# EasyEDA Pro project ProPrj_超市储物柜控制系统_2026-05-10.epro

# Schematic Schematic1
Assembly Variant: Basic; Board Name: Board1; Create Date: 2026-04-28; Page Name: P1; Project Name: 超市储物柜控制系统; Schematic Name: Schematic1; Update Date: 2026-04-28; BladeWidth: 10; Company: 嘉立创EDA; Page Size: A4; RegionStart: 1; ShowBorder: 1; TitleBlock: 1; TitleBlockPosition: 3; Version: V1.0; XRegionCount: 6; YRegionCount: 4
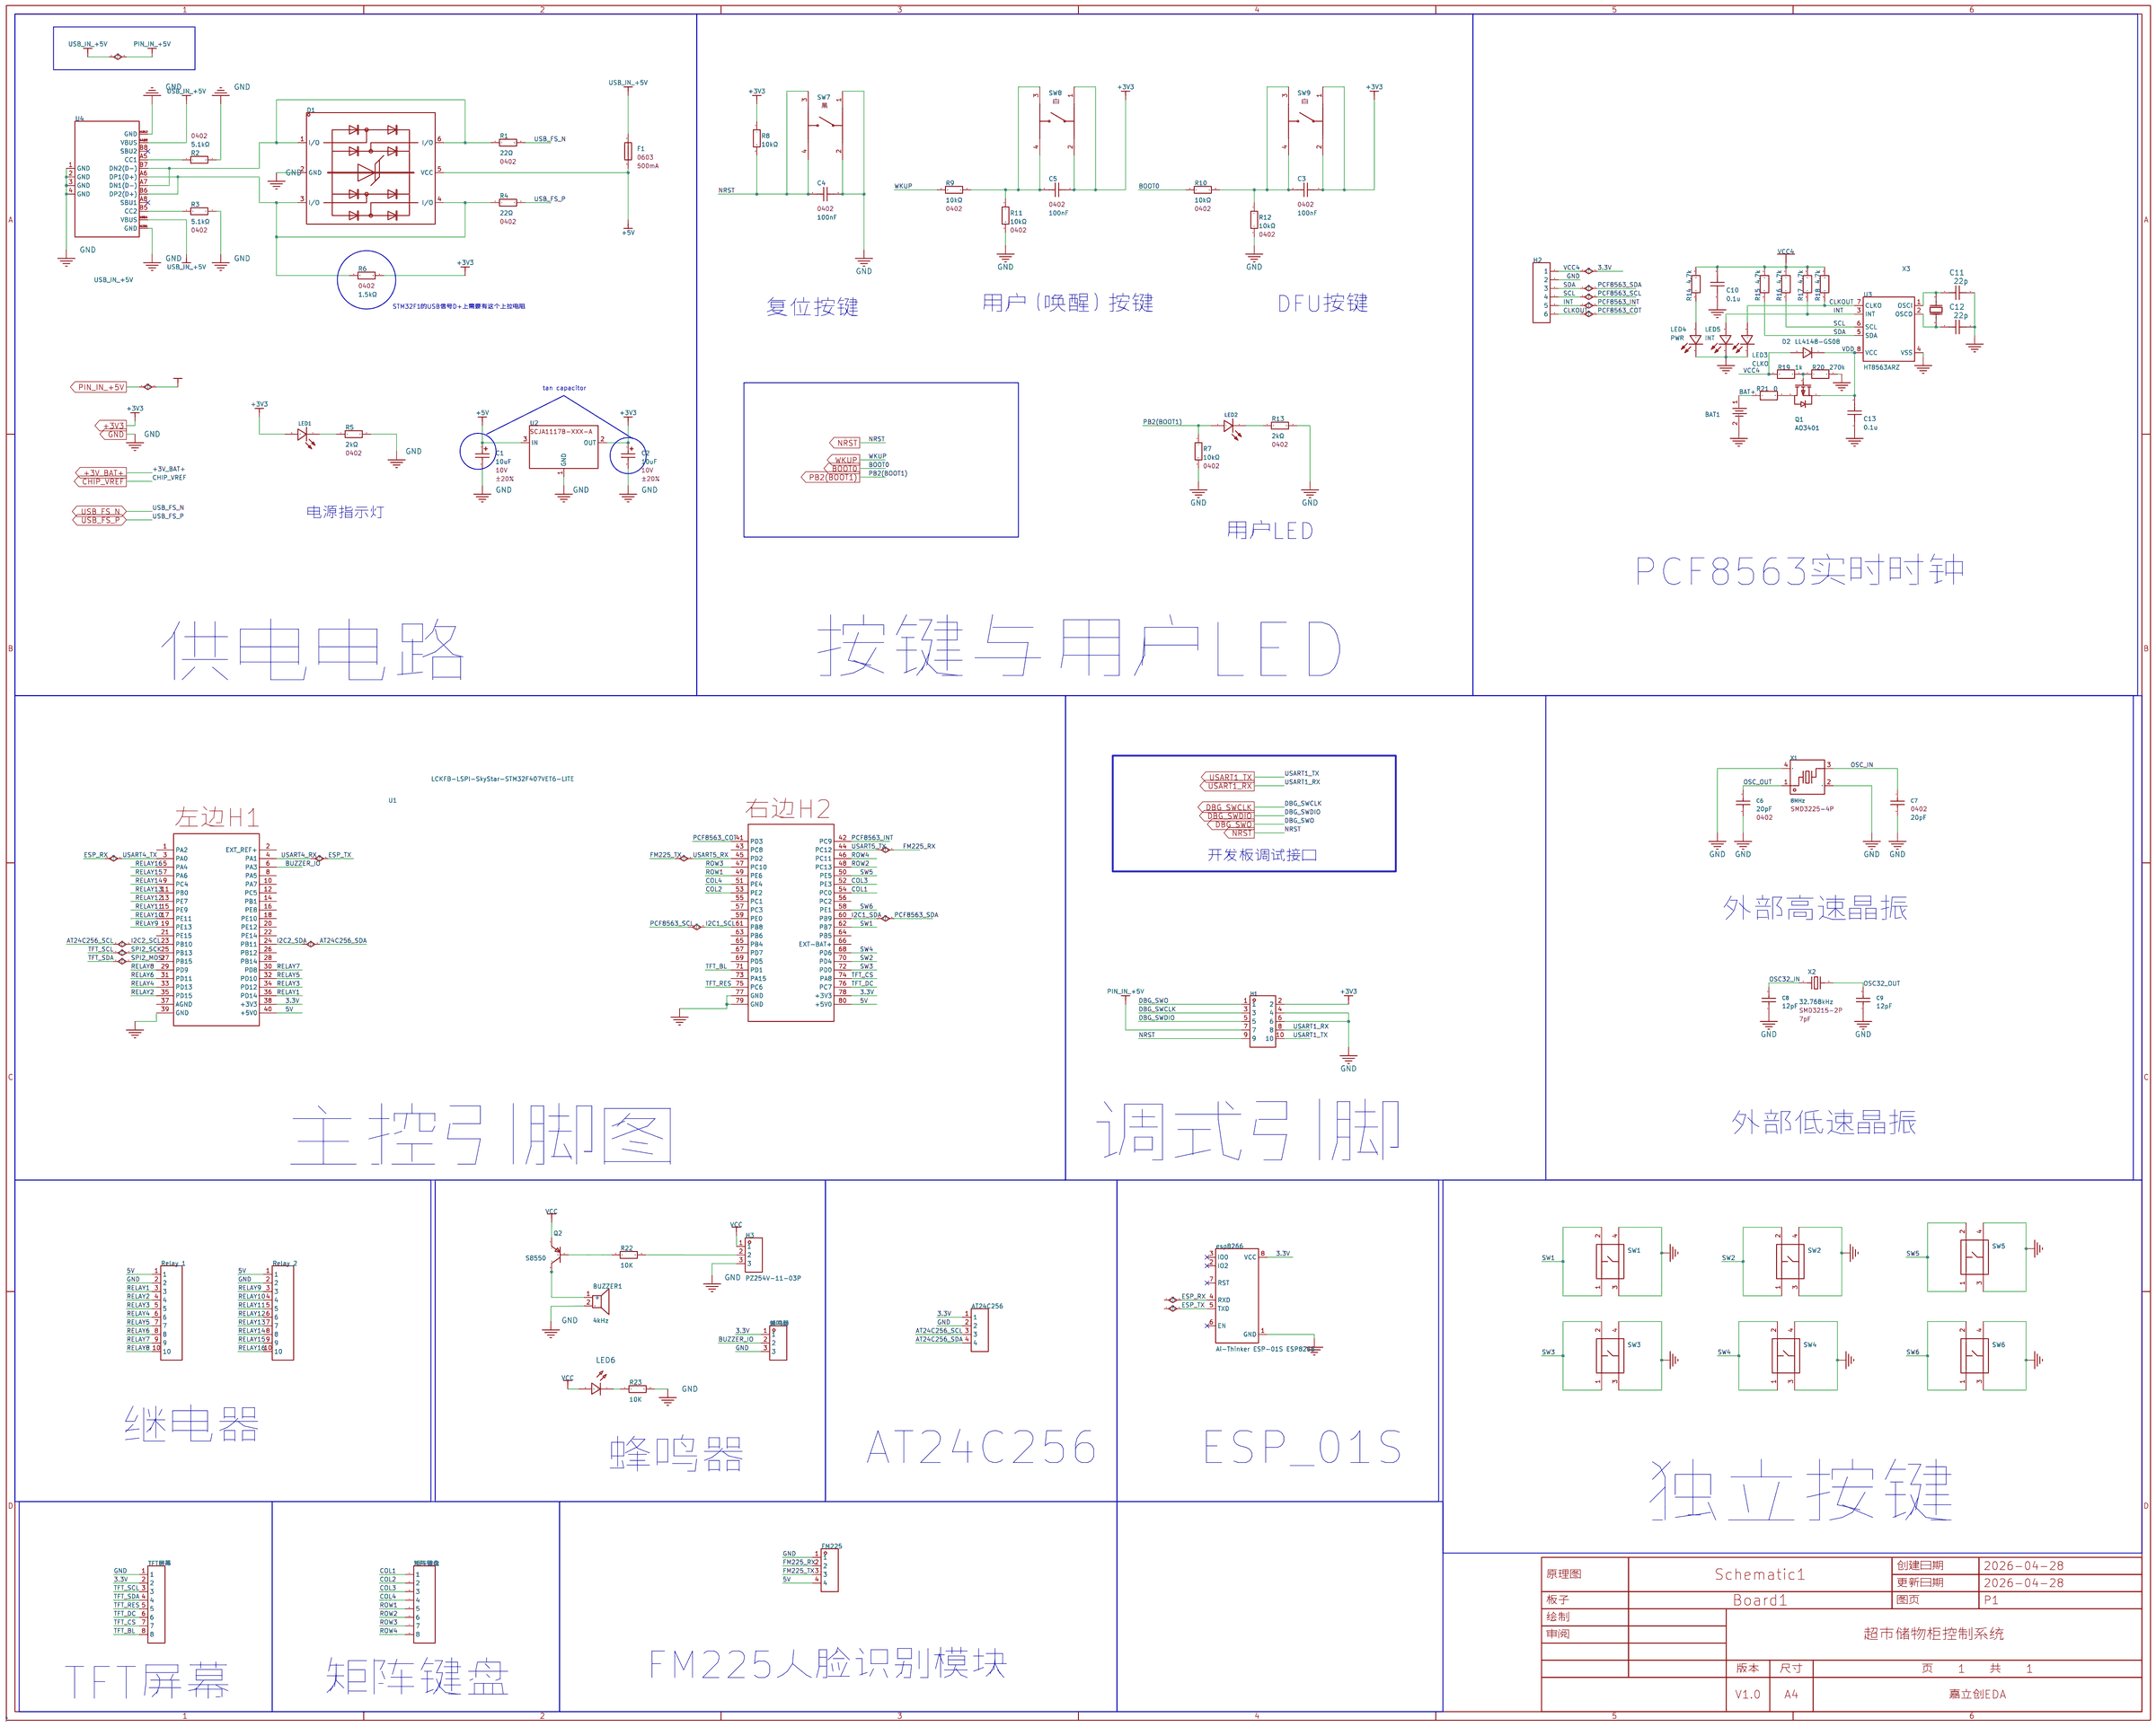
[diagram p0: schematic sheet]

## Parts
AT24C256  -  [HDR-TH_4P-P2.54-V-M]
BAT1  -  [BAT-TH_BS-02-A1AK006]
BUZZER1  4kHz  [BUZ-TH_BD12.0-P6.50-D0.6-FD]
C1  10uF  [CASE-A_3216]
C2  10uF  [CASE-A_3216]
C3  100nF  [C0402]
C4  100nF  [C0402]
C5  100nF  [C0402]
C6  20pF  [C0402(small)]
C7  20pF  [C0402(small)]
C8  12pF  [C0402(small)]
C9  12pF  [C0402(small)]
C10  0.1u  [C0805]
C11  22p  [C0805]
C12  22p  [C0805]
C13  0.1u  [C0805]
D1  BST236A054U  [SOT-23-6_L2.9-W1.6-P0.95-LS2.8-BR]
D2  LL4148-GS08  [SOD-80_L3.5-W1.5-RD]
esp8266  Ai-Thinker ESP-01S ESP8266  [WIFIM-TH_8P-L24.7-W14.4-P2.54]
F1  BSMD0603-050-6V  [F0603]
FM225  -  [HDR-TH_4P-P2.54-V-F]
H1  PZ254V-12-10P  [HDR-TH_10P-P2.54-V-M-R2-C5-S2.54]
H2  -  [HDR-TH_6P-P2.54-V-M-1]
H3  PZ254V-11-03P  [HDR-TH_3P-P2.54-V-M]
LED1  NCD0402R1  [LED0402-RD]
LED2  NCD0402G1  [LED0402-RD]
LED3  CLKO  [LED0805-R-RD]
LED4  PWR  [LED0805-R-RD]
LED5  INT  [LED0805-R-RD]
LED6  -  [LED_0805]
Q1  AO3401  [SOT-23-3_L2.9-W1.4-P1.90-LS2.6-BR]
Q2  S8550  [SOT-23-3_L2.9-W1.3-P1.90-LS2.4-BR]
R1  22Ω  [R0402]
R2  5.1kΩ  [R0402]
R3  5.1kΩ  [R0402]
R4  22Ω  [R0402]
R5  2kΩ  [R0402]
R6  1.5kΩ  [R0402]
R7  10kΩ  [R0402]
R8  10kΩ  [R0402]
R9  10kΩ  [R0402]
R10  10kΩ  [R0402]
R11  10kΩ  [R0402]
R12  10kΩ  [R0402]
R13  2kΩ  [R0402]
R14  4.7k  [R0805]
R15  4.7k  [R0805]
R16  4.7k  [R0805]
R17  4.7k  [R0805]
R18  4.7k  [R0805]
R19  1k  [R0603]
R20  270k  [R0603]
R21  0  [R0603]
R22  10K  [R0805]
R23  10K  [R0805]
Relay_1  -  [HDR-TH_10P-P2.54-V-M-1]
Relay_2  -  [HDR-TH_10P-P2.54-V-M-1]
SW1  K2-1102DP-C4SW-04  [KEY-TH_4P-L6.0-W6.0-P4.50-LS6.50]
SW2  K2-1102DP-C4SW-04  [KEY-TH_4P-L6.0-W6.0-P4.50-LS6.50]
SW3  K2-1102DP-C4SW-04  [KEY-TH_4P-L6.0-W6.0-P4.50-LS6.50]
SW4  K2-1102DP-C4SW-04  [KEY-TH_4P-L6.0-W6.0-P4.50-LS6.50]
SW5  K2-1102DP-C4SW-04  [KEY-TH_4P-L6.0-W6.0-P4.50-LS6.50]
SW6  K2-1102DP-C4SW-04  [KEY-TH_4P-L6.0-W6.0-P4.50-LS6.50]
SW7  TSA017A2540A03  [SW-SMD_4P-L4.2-W3.4-P2.15-LS5.2]
SW8  TSA017A2540A07  [SW-SMD_4P-L4.2-W3.4-P2.15-LS5.2]
SW9  TSA017A2540A07  [SW-SMD_4P-L4.2-W3.4-P2.15-LS5.2]
TFT屏幕  -  [HDR-TH_8P-P2.54-V-F-1]
U1  LCKFB-LSPI-SkyStar-STM32F407VET6-LITE  [COMM-TH_LCKFB-LSPI-SKYSTAR-STM32F407VET6-LITE]
U2  SCJA1117B-3.3-A  [SOT-89-3L_L4.5-W2.5-P1.50-LS4.1-BR]
U3  HT8563ARZ  [SOIC-8_L5.0-W4.0-P1.27-LS6.0-TL]
U4  USB-TYPE-C-019  [TYPE-C-SMD_HX-TYPE-C-16PIN]
X1  8MHz  [OSC-SMD_4P-L3.2-W2.5-BL]
X2  32.768kHz  [OSC-SMD_L3.2-W1.5]
X3  -  [32768晶振]
矩阵键盘  -  [HDR-TH_8P-P2.54-V-M]
蜂鸣器  -  [HDR-TH_3P-P2.54-V-M]

## Library data of the parts
AT24C256 = HDR-M_2.54_1x4P: Supplier Part: C492403; Supplier Footprint: 插件
BAT1 = CR2032电池座
BUZZER1 = SEA-12095-0540-42Ω-40P6.5: 驱动方式:无源(外部驱动);频率:4kHz;声压(SPL):85dB;; Supplier Part: C7428406; Manufacturer: S&S(海旭); Supplier Footprint: 插件,D=12mm; JLCPCB Part Class: 扩展库; Datasheet: https://item.szlcsc.com/datasheet/SEA-12095-0540-42%25CE%25A9-40P6.5/8424084.html; Supplier: LCSC; Driver Circuitry: 无源(外部驱动); Voltage - Supply: 5V; Sound Pressure Level(SPL): 85dB; Diameter(φD): 12mm; Height: 9.7mm
C1 C2 = CA45-A010M106T: 容值:10uF;精度:±20%;额定电压:10V;等效串联电阻:3Ω@100kHz;; LCSC Part Name: 10uF ±20% 10V; Supplier Part: C127946; Manufacturer: 湘怡中元/湘江; Supplier Footprint: CASE-A-3216; JLCPCB Part Class: 扩展库; Datasheet: https://atta.szlcsc.com/upload/public/pdf/source/20181017/C127946_A4A6D142F17DBAC79544D5AF423E91AE.pdf; Supplier: LCSC; Tolerance: ±20%; Rated Voltage: 10V; Equivalent Series Resistance(ESR): 3Ω@100kHz; Operating Temperature: -55℃~+125℃
C3-C5 = CC0402KRX7R7BB104: 容值:100nF;精度:±10%;额定电压:16V;材质(温度系数):X7R;; LCSC Part Name: 100nF ±10% 16V; Supplier Part: C60474; Manufacturer: YAGEO(国巨); Supplier Footprint: 0402; Datasheet: https://atta.szlcsc.com/upload/public/pdf/source/20211223/9278FD768280B81DDBEF48FA36411A03.pdf; Supplier: LCSC; Tolerance: ±10%; Voltage Rated: 16V; Temperature Coefficient: X7R
C6 C7 = 0402CG200J500NT: 容值:20pF;精度:±5%;额定电压:50V;材质(温度系数):C0G;; LCSC Part Name: 20pF ±5% 50V; Supplier Part: C1554; Manufacturer: FH(风华); Supplier Footprint: 0402; JLCPCB Part Class: 基础库; Datasheet: https://atta.szlcsc.com/upload/public/pdf/source/20200305/C486355_26A10D38EF8C2A5C37091D0039909270.pdf; Supplier: LCSC; Tolerance: ±5%; Voltage Rated: 50V; Temperature Coefficient: C0G
C8 C9 = 0402CG6R0C500NT: 容值:12pF;精度:±5%;额定电压:50V;材质(温度系数):C0G;; LCSC Part Name: 12pF ±5% 50V; Supplier Part: C1547; Manufacturer: FH(风华); Manufacturer Part: 0402CG120J500NT; Supplier Footprint: 0402; JLCPCB Part Class: Basic Part; Datasheet: https://atta.szlcsc.com/upload/public/pdf/source/20200305/C486355_26A10D38EF8C2A5C37091D0039909270.pdf; Supplier: LCSC; Voltage Rated: 50V; Temperature Coefficient: C0G
C10 C13 = 0.1u: link: https://item.szlcsc.com/373011.html; 3DModel: C0805_L2.0-W1.3-H1.3
C11 C12 = 22p: link: https://item.szlcsc.com/373011.html; 3DModel: C0805_L2.0-W1.3-H1.3
D1 = BST236A054U（自修改）: 反向关断电压（典型值）:5V;击穿电压（最小值）:6V;极性:-;箝位电压:13V;峰值脉冲电流（10/1000us）:3.5A (8/20us);; Supplier Part: C406203; Manufacturer: BORN(伯恩半导体); Supplier Footprint: SOT23-6; JLCPCB Part Class: 扩展库; Datasheet: https://atta.szlcsc.com/upload/public/pdf/source/20190723/C406203_BF93A0BD7D0538F0A550B5A01DEB1E59.pdf; Supplier: LCSC
D2 = LL4148-GS08: 二极管配置:-;正向压降(Vf):860mV@50mA;直流反向耐压(Vr):75V;整流电流:300mA;反向恢复时间(Trr):-;; Supplier Part: C68883; Manufacturer: VISHAY(威世); Supplier Footprint: MiniMELF; JLCPCB Part Class: 扩展库; Datasheet: https://atta.szlcsc.com/upload/public/pdf/source/20160803/1470206543327.pdf; Supplier: LCSC; Voltage - Forward(Vf@If): 860mV@50mA; Voltage - DC Reverse(Vr): 75V; Current - Rectified: 300mA; Reverse Leakage Current (Ir): 5uA@75V
esp8266 = Ai-Thinker ESP-01S ESP8266: Supplier Part: C17606792; Manufacturer: Ai-Thinker(安信可); JLCPCB Part Class: Extended Part; Datasheet: https://item.szlcsc.com/datasheet/Ai-Thinker%2520ESP-01S%2520ESP8266/18736031.html; Supplier: LCSC
F1 = BSMD0603-050-6V: 最大电压:6V;最大电流:40A;保持电流:500mA;跳闸电流:1A;; LCSC Part Name: 6V 500mA 0603自恢复; Supplier Part: C883095; Manufacturer: BHFUSE(佰宏); Supplier Footprint: 0603; JLCPCB Part Class: 扩展库; Datasheet: https://atta.szlcsc.com/upload/public/pdf/source/20220302/2A4AFA61964160B34367BDE2745D6217.pdf; Supplier: LCSC; Operating Voltage (Max): 6V; Current Rating (Max): 40A; Hold Current: 500mA; Trip Current: 1A; Power Dissipation: 500mW; Resistance - Initial (Ri) (Min): 100mΩ; Resistance - Post Trip (R1) (Max): 800mΩ; Maximum Time to Trip: 100ms; Operating Temperature: -40℃~+85℃
FM225 = HDR-F_2.54_1x4P: Supplier Part: C2718488; Supplier Footprint: 插件
H1 = PZ254V-12-10P（改成侧插）: 排数:双排;总PIN位数:10;间距:2.54mm;插针结构:2x5P;行距:2.54mm;安装类型:直插;圆针/方针:方针;额定电流:-;额定电压:-;配合针长度:6mm;塑高:2.5mm;端接针长度:3mm;触头材质:黄铜;触头镀层:-;工作温度范围:-40℃~+105℃;颜色:黑色;; LCSC Part Name: 2.54mm 2x5P 直插 方针; Supplier Part: C492422; Manufacturer: XFCN(兴飞); Supplier Footprint: 直插,P=2.54mm; JLCPCB Part Class: 扩展库; Supplier: LCSC; Number of Rows: 双排; Number of Pins: 10; Pitch: 2.54mm; Pin Structure: 2x5P; Row Spacing: 2.54mm; Mounting Type: 直插; Circluar Pins/Square Pins: 方针; Length of Mating Pin: 6mm; Insulation Height: 2.5mm; Length of End Connection Pin: 3mm; Contact Material: 黄铜; Operating Temperature Range: -40℃~+105℃; Color: 黑色
H2 = HDR-M_2.54_1x6P: Supplier Part: C37208; Supplier Footprint: 插件
H3 = PZ254V-11-03P: 插针结构:1x3P;间距:2.54mm;行距:-;圆针/方针:方针;安装方式:直插;排数:单排;总PIN位数:3P;额定电流:3A;额定电压:250V;配合针长度:6mm;塑高:2.5mm;端接针长度:3mm;工作温度:-40℃~+105℃;颜色:黑色;; LCSC Part Name: 1x3P 间距:2.54mm 方针 直插; Supplier Part: C2937625; Manufacturer: XFCN(兴飞); Supplier Footprint: 插件,P=2.54mm; JLCPCB Part Class: Extended Part; Datasheet: https://item.szlcsc.com/datasheet/PZ254V-11-03P/3293280.html; Supplier: LCSC; Pin Structure: 1x3P; Pitch: 2.54mm; Circluar Pins/Square Pins: 方针; Mounting Type: 直插; Number of Rows: 单排; Number of Pins: 3P; Current Rating: 3A; Voltage Rating (Max): 250V; Length of Mating Pin: 6mm; Insulation Height: 2.5mm; Length of End Connection Pin: 3mm; Operating Temperature: -40℃~+105℃; Color: 黑色
LED1 = NCD0402R1: 发光颜色:红灯;; Supplier Part: C130719; Manufacturer: 国星光电; Supplier Footprint: 0402; JLCPCB Part Class: 扩展库; Datasheet: https://atta.szlcsc.com/upload/public/pdf/source/20200820/C130719_A72EA5A7FEC83C35856EA0453E4EE775.pdf; Supplier: LCSC; Emitted Color: 红灯
LED2 = NCD0402G1: 发光颜色:翠绿;; LCSC Part Name: 翠绿 0402翠绿       正贴; Supplier Part: C130723; Manufacturer: 国星光电; Supplier Footprint: 0402; JLCPCB Part Class: 扩展库; Datasheet: https://atta.szlcsc.com/upload/public/pdf/source/20200820/C130723_D39B4171A1B8D8D2F39C1DC521C0922A.pdf; Supplier: LCSC; Emitted Color: 翠绿
LED3-LED5 = LED_Green
LED6 = LED_0805-R: Supplier Footprint: 0805
Q1 = AO3401_C727156: 类型:1个P沟道;漏源电压(Vdss):30V;连续漏极电流(Id):4.2A;导通电阻(RDS(on)@Vgs,Id):65mΩ@10V,4.2A;功率:350mW;阈值电压(Vgs(th)@Id):1.3V@250uA;; LCSC Part Name: 1个P沟道 耐压:30V 电流:4.2A; Supplier Part: C727156; Manufacturer: TWGMC(台湾迪嘉); Supplier Footprint: SOT-23; JLCPCB Part Class: 扩展库; Datasheet: https://atta.szlcsc.com/upload/public/pdf/source/20200827/C727156_6E081BBEEFBC6B8FEE164CB196B0AF30.pdf; Supplier: LCSC; Type: 1个P沟道; Drain Source Voltage (Vdss): 30V; Continuous Drain Current (Id): 4.2A; Drain Source On Resistance (RDS(on)@Vgs,Id): 65mΩ@10V,4.2A; Power Dissipation (Pd): 350mW; Gate Threshold Voltage (Vgs(th)@Id): 1.3V@250uA; Input Capacitance (Ciss@Vds): 954pF; Reverse Transfer Capacitance (Crss@Vds): 77pF; Operating Temperature: -55℃~+150℃
Q2 = S8550_C5184407: 晶体管类型:PNP;集电极电流(Ic):500mA;集射极击穿电压(Vceo):25V;耗散功率(Pd):300mW;直流电流增益(hFE):120@50mA,1V;; LCSC Part Name: PNP 电流:0.5A 电压:25V; Supplier Part: C5184407; Manufacturer: HXY MOSFET(华轩阳电子); Supplier Footprint: SOT-23; JLCPCB Part Class: 扩展库; Datasheet: https://item.szlcsc.com/datasheet/S8550/5849843.html; Supplier: LCSC; type: PNP; Current - Collector(Ic): 500mA; Collector - Emitter Voltage VCEO: 25V; Pd - Power Dissipation: 300mW; DC Current Gain: 120@50mA,1V; Transition frequency(fT): 150MHz; Current - Collector Cutoff: 100nA; Vce Saturation(VCE(sat)): 600mV
R1 R4 = RC0402FR-0722RL: 电阻类型:厚膜电阻;阻值:22Ω;精度:±1%;功率:62.5mW;; LCSC Part Name: 22Ω ±1% 62.5mW; Supplier Part: C114765; Manufacturer: YAGEO(国巨); Supplier Footprint: 0402; JLCPCB Part Class: 扩展库; Datasheet: https://atta.szlcsc.com/upload/public/pdf/source/20170912/C114765_1505207820880963483.pdf; Supplier: LCSC; Type: 厚膜电阻; Tolerance: ±1%; Power(Watts): 62.5mW; Temperature Coefficient: ±100ppm/℃; Overload Voltage (Max): 50V; Operating Temperature Range: -55℃~+155℃
R2 R3 = RC0402FR-075K1L: 电阻类型:厚膜电阻;阻值:5.1kΩ;精度:±1%;功率:62.5mW;; LCSC Part Name: 5.1kΩ ±1% 62.5mW; Supplier Part: C105872; Manufacturer: YAGEO(国巨); Supplier Footprint: 0402; JLCPCB Part Class: 扩展库; Datasheet: https://atta.szlcsc.com/upload/public/pdf/source/20170912/C105872_1505207464555963229.pdf; Supplier: LCSC; Type: 厚膜电阻; Tolerance: ±1%; Power(Watts): 62.5mW; Temperature Coefficient: ±100ppm/℃; Overload Voltage (Max): 50V; Operating Temperature Range: -55℃~+155℃
R5 R13 = 0402WGF2001TCE: 电阻类型:厚膜电阻;阻值:2kΩ;精度:±1%;功率:62.5mW;; LCSC Part Name: 2kΩ ±1% 62.5mW; Supplier Part: C4109; Manufacturer: UNI-ROYAL(厚声); Supplier Footprint: 0402; JLCPCB Part Class: 基础库; Datasheet: https://atta.szlcsc.com/upload/public/pdf/source/20200306/C422600_1E6D84923E4A46A82E41ADD87F860B5C.pdf; Supplier: LCSC; Type: 厚膜电阻; Tolerance: ±1%; Power(Watts): 62.5mW; Temperature Coefficient: ±100ppm/℃; Overload Voltage (Max): 50V; Operating Temperature Range: -55℃~+155℃
R6 = 0402WGF1501TCE: 电阻类型:厚膜电阻;阻值:1.5kΩ;精度:±1%;功率:62.5mW;; LCSC Part Name: 1.5kΩ ±1% 62.5mW; Supplier Part: C25867; Manufacturer: UNI-ROYAL(厚声); Supplier Footprint: 0402; JLCPCB Part Class: 基础库; Datasheet: https://atta.szlcsc.com/upload/public/pdf/source/20200306/C422600_1E6D84923E4A46A82E41ADD87F860B5C.pdf; Supplier: LCSC; Type: 厚膜电阻; Tolerance: ±1%; Power(Watts): 62.5mW; Temperature Coefficient: ±100ppm/℃; Overload Voltage (Max): 50V; Operating Temperature Range: -55℃~+155℃
R7-R12 = RC0402FR-0710KL: 电阻类型:厚膜电阻;阻值:10kΩ;精度:±1%;功率:62.5mW;; LCSC Part Name: 10kΩ ±1% 62.5mW; Supplier Part: C60490; Manufacturer: YAGEO(国巨); Supplier Footprint: 0402; JLCPCB Part Class: 扩展库; Datasheet: https://atta.szlcsc.com/upload/public/pdf/source/20170606/1496716515432.pdf; Supplier: LCSC; Type: 厚膜电阻; Tolerance: ±1%; Power(Watts): 62.5mW; Temperature Coefficient: ±100ppm/℃; Overload Voltage (Max): 50V; Operating Temperature Range: -55℃~+155℃
R14-R18 R21 = 4.7k_0805: link: https://item.szlcsc.com/142685.html; 3DModel: R0805_L2.0-W1.3-H0.6
R19 R20 = 1k_0805: link: https://item.szlcsc.com/142685.html; 3DModel: R0805_L2.0-W1.3-H0.6
R22 R23 = Res_0805: Supplier Footprint: 0805
Relay_1 Relay_2 = HDR-M_2.54_1x10P: Supplier Part: C57369; Supplier Footprint: 插件
SW1-SW6 = K2-1102DP-C4SW-04: 电路结构:单刀单掷;按钮形状:圆形按钮;作用力:2.5N;安装方式:直插;开关长度:6mm;开关宽度:6mm;开关高度:5mm;触点电流:50mA;额定电压:12V;带灯:-;工作寿命:10万次;; LCSC Part Name: 轻触按键开关6*6*5; Supplier Part: C110153; Manufacturer: 韩国韩荣; Supplier Footprint: 插件-4P,6x6mm; JLCPCB Part Class: Extended Part; Datasheet: https://item.szlcsc.com/datasheet/K2-1102DP-C4SW-04/111374.html; Supplier: LCSC; Circuit: 单刀单掷; Actuator Style: 圆形按钮; Operating Force: 2.5N; Mounting Type: 直插; Length: 6mm; Width: 6mm; Switch Height: 5mm; Contact Current: 50mA; Voltage Rating: 12V; Life: 10万次; Operating Temperature: -25℃~+85℃
SW7 = TSA017A2540A03: 触点电流:50mA;额定电压(AC):-;额定电压(DC):12V;安装方式:立贴;机械寿命:-;; LCSC Part Name: 4.2*3.35*2.5mm 立贴 轻触开关; Supplier Part: C2888435; Manufacturer: BZCN(博众电气); Supplier Footprint: SMD; JLCPCB Part Class: 扩展库; Datasheet: https://atta.szlcsc.com/upload/public/pdf/source/20210906/F29F74F1A6DE5E6C38338EAD973C3529.pdf; Supplier: LCSC; Contact Current: 50mA; Voltage Rating (DC): 12V; Mounting Style: 立贴; Actuator Style: 椭圆形按钮; Switch Length: 4.2mm; Switch Width: 3.35mm; Switch Height: 2.5mm; 键帽颜色: 黑
SW8 SW9 = TSA017A2540A07: 触点电流:50mA;额定电压(AC):-;额定电压(DC):12V;安装方式:立贴;机械寿命:-;; LCSC Part Name: 4.2*3.35*2.5mm 立贴 轻触开关; Supplier Part: C2888434; Manufacturer: BZCN(博众电气); Supplier Footprint: SMD; JLCPCB Part Class: 扩展库; Datasheet: https://atta.szlcsc.com/upload/public/pdf/source/20210906/F29F74F1A6DE5E6C38338EAD973C3529.pdf; Supplier: LCSC; Contact Current: 50mA; Voltage Rating (DC): 12V; Mounting Style: 立贴; Actuator Style: 椭圆形按钮; Switch Length: 4.2mm; Switch Width: 3.35mm; Switch Height: 2.5mm; 键帽颜色: 白
TFT屏幕 = HDR-F_2.54_1x8P: Supplier Part: C27438; Supplier Footprint: 插件
U1 = LCKFB-LSPI-SkyStar-STM32F407VET6-LITE: 单板,不送排针; LCSC Part Name: 立创·天空星开发板-STM32F407VET6-青春版; Supplier Part: C22370035; Manufacturer: 立创开发板; JLCPCB Part Class: Extended Part; Datasheet: https://item.szlcsc.com/datasheet/LCKFB-LSPI-SkyStar-STM32F407VET6-LITE/23849165.html; Supplier: LCSC
U2 = SCJA1117B-3.3-A（自修改）: Supplier Part: C2829327; Manufacturer: CJ(江苏长电/长晶); Supplier Footprint: SOT-89-3L; JLCPCB Part Class: 扩展库; Datasheet: https://atta.szlcsc.com/upload/public/pdf/source/20210820/B9D5D49B36ECC270645A4509A675D809.pdf; Supplier: LCSC
U3 = HT8563ARZ: Supplier Part: C2834465; Manufacturer: HTCSEMI(海天芯); Supplier Footprint: SOIC-8; JLCPCB Part Class: 扩展库; Datasheet: https://atta.szlcsc.com/upload/public/pdf/source/20210820/7D8BECBBB1F4BED9191CC1F7D794CAA1.pdf; Supplier: LCSC
U4 = USB-TYPE-C-019（自修改）: 修改原理图封装; Supplier: LCSC; Supplier Part: C2927039; Manufacturer: DEALON(德艺隆); link: https://atta.szlcsc.com/upload/public/pdf/source/20211217/AE540A2D77B84677A3A029B8D0DDD2E1.pdf; JLCPCB Part Class: 扩展库; Supplier Footprint: 插件
X1 = X32258MOB4SI: 频率:8MHz;频率公差:±10ppm;负载电容:12pF;; LCSC Part Name: 8MHz ±10ppm 12pF YSX321SL; Supplier Part: C2682775; Manufacturer: YXC(扬兴晶振); Supplier Footprint: SMD3225-4P; JLCPCB Part Class: 扩展库; Datasheet: https://atta.szlcsc.com/upload/public/pdf/source/20210106/C2682774_0CD4FDA5D9DA3FBEEC23BD607A48E4B0.pdf; Supplier: LCSC; Crystal Type: 贴片无源晶振; Frequency Tolerance: ±10ppm; Frequency Stability: ±30ppm; Load Capacitance: 12pF; Equivalent Series Resistance (ESR): 150Ω; Operating Temperature: -40℃~+85℃
X2 = XKXEL89CJI-SUAYLC-32.768K: 频率:32.768kHz;频率公差:±20ppm;负载电容:7pF;; LCSC Part Name: 32.768kHz ±20ppm 7pF YST310S; Supplier Part: C7528807; Manufacturer: YXC(扬兴晶振); Supplier Footprint: SMD3215-2P; Datasheet: https://atta.szlcsc.com/upload/public/pdf/source/20210329/C620155_E5A74FC0D27C5E9015A8D75DE9484FEA.pdf; Supplier: LCSC; Crystal Type: 贴片无源晶振; Frequency Tolerance: ±20ppm; Load Capacitance: 7pF; Operating Temperature: -40℃~+85℃
X3 = 32768Hz晶振
矩阵键盘 = HDR-M_2.54_1x8P: Supplier Part: C124381; Supplier Footprint: 插件
蜂鸣器 = HDR-M_2.54_1x3P: Supplier Part: C2937625; Supplier Footprint: 插件

## Nets
5V: FM225.4 Relay_1.1 Relay_2.1 U1.40(+5V0) U1.80(+5V0)
+3V3: C2.1 C3.1 C5.1 H1.2 LED1.2(A) R6.2 R8.1 SW8.1 SW8.2 SW9.1 SW9.2 U2.2(OUT)
+5V: C1.1 D1.5(VCC) F1.2 U2.3(IN)
GND: AT24C256.2 BAT1.2 C1.2 C2.2 C4.1 C6.1 C7.2 C8.1 C9.1 C10.1 C11.1 C12.1 C13.1 D1.2(GND) esp8266.1(GND) FM225.1 H1.4 H1.6 H2.2 LED3.2(K) LED4.2(K) LED5.2(K) R2.2 R3.2 R5.2 R7.2 R11.2 R12.2 R13.2 R20.2 Relay_1.2 Relay_2.2 SW1.3 SW1.4 SW2.3 SW2.4 SW3.3 SW3.4 SW4.3 SW4.4 SW5.3 SW5.4 SW6.3 SW6.4 SW7.1 SW7.2 TFT屏幕.1 U1.39(GND) U1.77(GND) U1.79(GND) U2.1(GND) U3.4(VSS) U4.1(GND) U4.2(GND) U4.3(GND) U4.4(GND) U4.A1B12(GND) U4.A12B1(GND) X1.2(GND) X1.4(GND) 蜂鸣器.3
VCC4: AT24C256.1 C10.2 D2.2(A) esp8266.8(VCC) H2.1 R14.2 R15.1 R16.1 R17.2 R18.2 R19.1 TFT屏幕.2 U1.38(+3V3) U1.78(+3V3) 蜂鸣器.1
VDD: C13.2 D2.1(C) Q1.2(S) U3.8(VCC)
AT24C256_SCL: AT24C256.3 U1.23(PB10)
AT24C256_SDA: AT24C256.4 U1.24(PB11)
BAT+: BAT1.1 R21.1
BOOT0: R10.1
BUZZER_IO: U1.6(PA3) 蜂鸣器.2
CLKOUT: H2.6 LED3.1(A) R18.1 U1.41(PD3) U3.7(CLKO)
COL1: U1.54(PC0) 矩阵键盘.1
COL2: U1.53(PE2) 矩阵键盘.2
COL3: U1.52(PE3) 矩阵键盘.3
COL4: U1.51(PE4) 矩阵键盘.4
DBG_SWCLK: H1.3
DBG_SWDIO: H1.5
DBG_SWO: H1.1
ESP_RX: esp8266.4(RXD) U1.3(PA0)
ESP_TX: esp8266.5(TXD) U1.4(PA1)
FM225_RX: FM225.2 U1.44(PC12)
FM225_TX: FM225.3 U1.45(PD2)
I2C1_SCL: H2.4 R16.2 U1.61(PB8) U3.6(SCL)
I2C1_SDA: H2.3 R15.2 U1.60(PB9) U3.5(SDA)
INT: H2.5 LED5.1(A) R17.1 U1.42(PC9) U3.3(INT)
NRST: C4.2 H1.9 R8.2 SW7.3 SW7.4
OSC32_IN: C8.2 X2.1
OSC32_OUT: C9.2 X2.2
OSC_IN: C7.1 X1.3
OSC_OUT: C6.2 X1.1
PB2(BOOT1): LED2.2(A) R7.1
PIN_IN_+5V: F1.1 H1.7 U4.A4B9(VBUS) U4.A9B4(VBUS)
RELAY1: Relay_1.3 U1.36(PD14)
RELAY2: Relay_1.4 U1.35(PD15)
RELAY3: Relay_1.5 U1.34(PD12)
RELAY4: Relay_1.6 U1.33(PD13)
RELAY5: Relay_1.7 U1.32(PD10)
RELAY6: Relay_1.8 U1.31(PD11)
RELAY7: Relay_1.9 U1.30(PD8)
RELAY8: Relay_1.10 U1.29(PD9)
RELAY9: Relay_2.3 U1.19(PE13)
RELAY10: Relay_2.4 U1.17(PE11)
RELAY11: Relay_2.5 U1.15(PE9)
RELAY12: Relay_2.6 U1.13(PE7)
RELAY13: Relay_2.7 U1.11(PB0)
RELAY14: Relay_2.8 U1.9(PC4)
RELAY15: Relay_2.9 U1.7(PA6)
RELAY16: Relay_2.10 U1.5(PA4)
ROW1: U1.49(PE6) 矩阵键盘.5
ROW2: U1.48(PC13) 矩阵键盘.6
ROW3: U1.47(PC10) 矩阵键盘.7
ROW4: U1.46(PC11) 矩阵键盘.8
SPI2_MOSI: TFT屏幕.4 U1.27(PB15)
SPI2_SCK: TFT屏幕.3 U1.25(PB13)
SW1: SW1.1 SW1.2 U1.62(PB7)
SW2: SW2.1 SW2.2 U1.70(PD4)
SW3: SW3.1 SW3.2 U1.72(PD0)
SW4: SW4.1 SW4.2 U1.68(PD6)
SW5: SW5.1 SW5.2 U1.50(PE5)
SW6: SW6.1 SW6.2 U1.58(PE1)
TFT_BL: TFT屏幕.8 U1.71(PD1)
TFT_CS: TFT屏幕.7 U1.74(PA8)
TFT_DC: TFT屏幕.6 U1.76(PC7)
TFT_RES: TFT屏幕.5 U1.75(PC6)
USART1_RX: H1.8
USART1_TX: H1.10
USB_FS_N: R1.2
USB_FS_P: R4.2
WKUP: R9.1
Net-(C3-2): C3.2 R10.2 R12.1 SW9.3 SW9.4
Net-(C5-2): C5.2 R9.2 R11.1 SW8.3 SW8.4
Net-(C11-2): C11.2 U3.1(OSCI) X3.1(OSC1)
Net-(C12-2): C12.2 U3.2(OSCO) X3.2(OSC2)
Net-(D1-1): D1.1(I/O) D1.6(I/O) R1.1 U4.A7(DN1(D-)) U4.B7(DN2(D-))
Net-(D1-3): D1.3(I/O) D1.4(I/O) R4.1 R6.1 U4.A6(DP1(D+)) U4.B6(DP2(D+))
Net-(LED1-1): LED1.1(K) R5.1
Net-(LED2-1): LED2.1(K) R13.1
Net-(LED4-1): LED4.1(A) R14.1
Net-(Q1-1): Q1.1(G) R19.2 R20.1
Net-(Q1-3): Q1.3(D) R21.2
Net-(R2-1): R2.1 U4.A5(CC1)
Net-(R3-1): R3.1 U4.B5(CC2)

Not connected (* = marked no-connect by the designer): BUZZER1 1(+) 2; esp8266 2(IO2)* 3(IO0)* 6(EN)* 7(RST)*; H3 1 2 3; LED6 1(C) 2(A); Q2 1(B) 2(E) 3(C); R22 1 2; R23 1 2; U1 1(PA2) 2(EXT REF+) 8(PA5) 10(PA7) 12(PC5) 14(PB1) 16(PE8) 18(PE10) 20(PE12) 21(PE15) 22(PE14) 26(PB12) 28(PB14) 37(AGND) 43(PC8) 55(PC1) 56(PC2) 57(PC3) 59(PE0) 63(PB6) 64(PB5) 65(PB4) 66(EXT-BAT+) 67(PD7) 69(PD5) 73(PA15); U4 A8(SBU1)* B8(SBU2)*

## Notes on the sheet
- STM32F1的USB信号D+上需要有这个上拉电阻
- 用户（唤醒）按键
- DFU按键
- 复位按键
- tan capacitor
- 电源指示灯
- 用户LED
- PCF8563实时时钟
- 供电电路
- 按键与用户LED
- 开发板调试接口
- 外部高速晶振
- 外部低速晶振
- 主控引脚图
- 调式引脚
- 继电器
- AT24C256
- ESP_01S
- 蜂鸣器
- 独立按键
- FM225人脸识别模块
- 矩阵键盘
- TFT屏幕

# Board PCB1
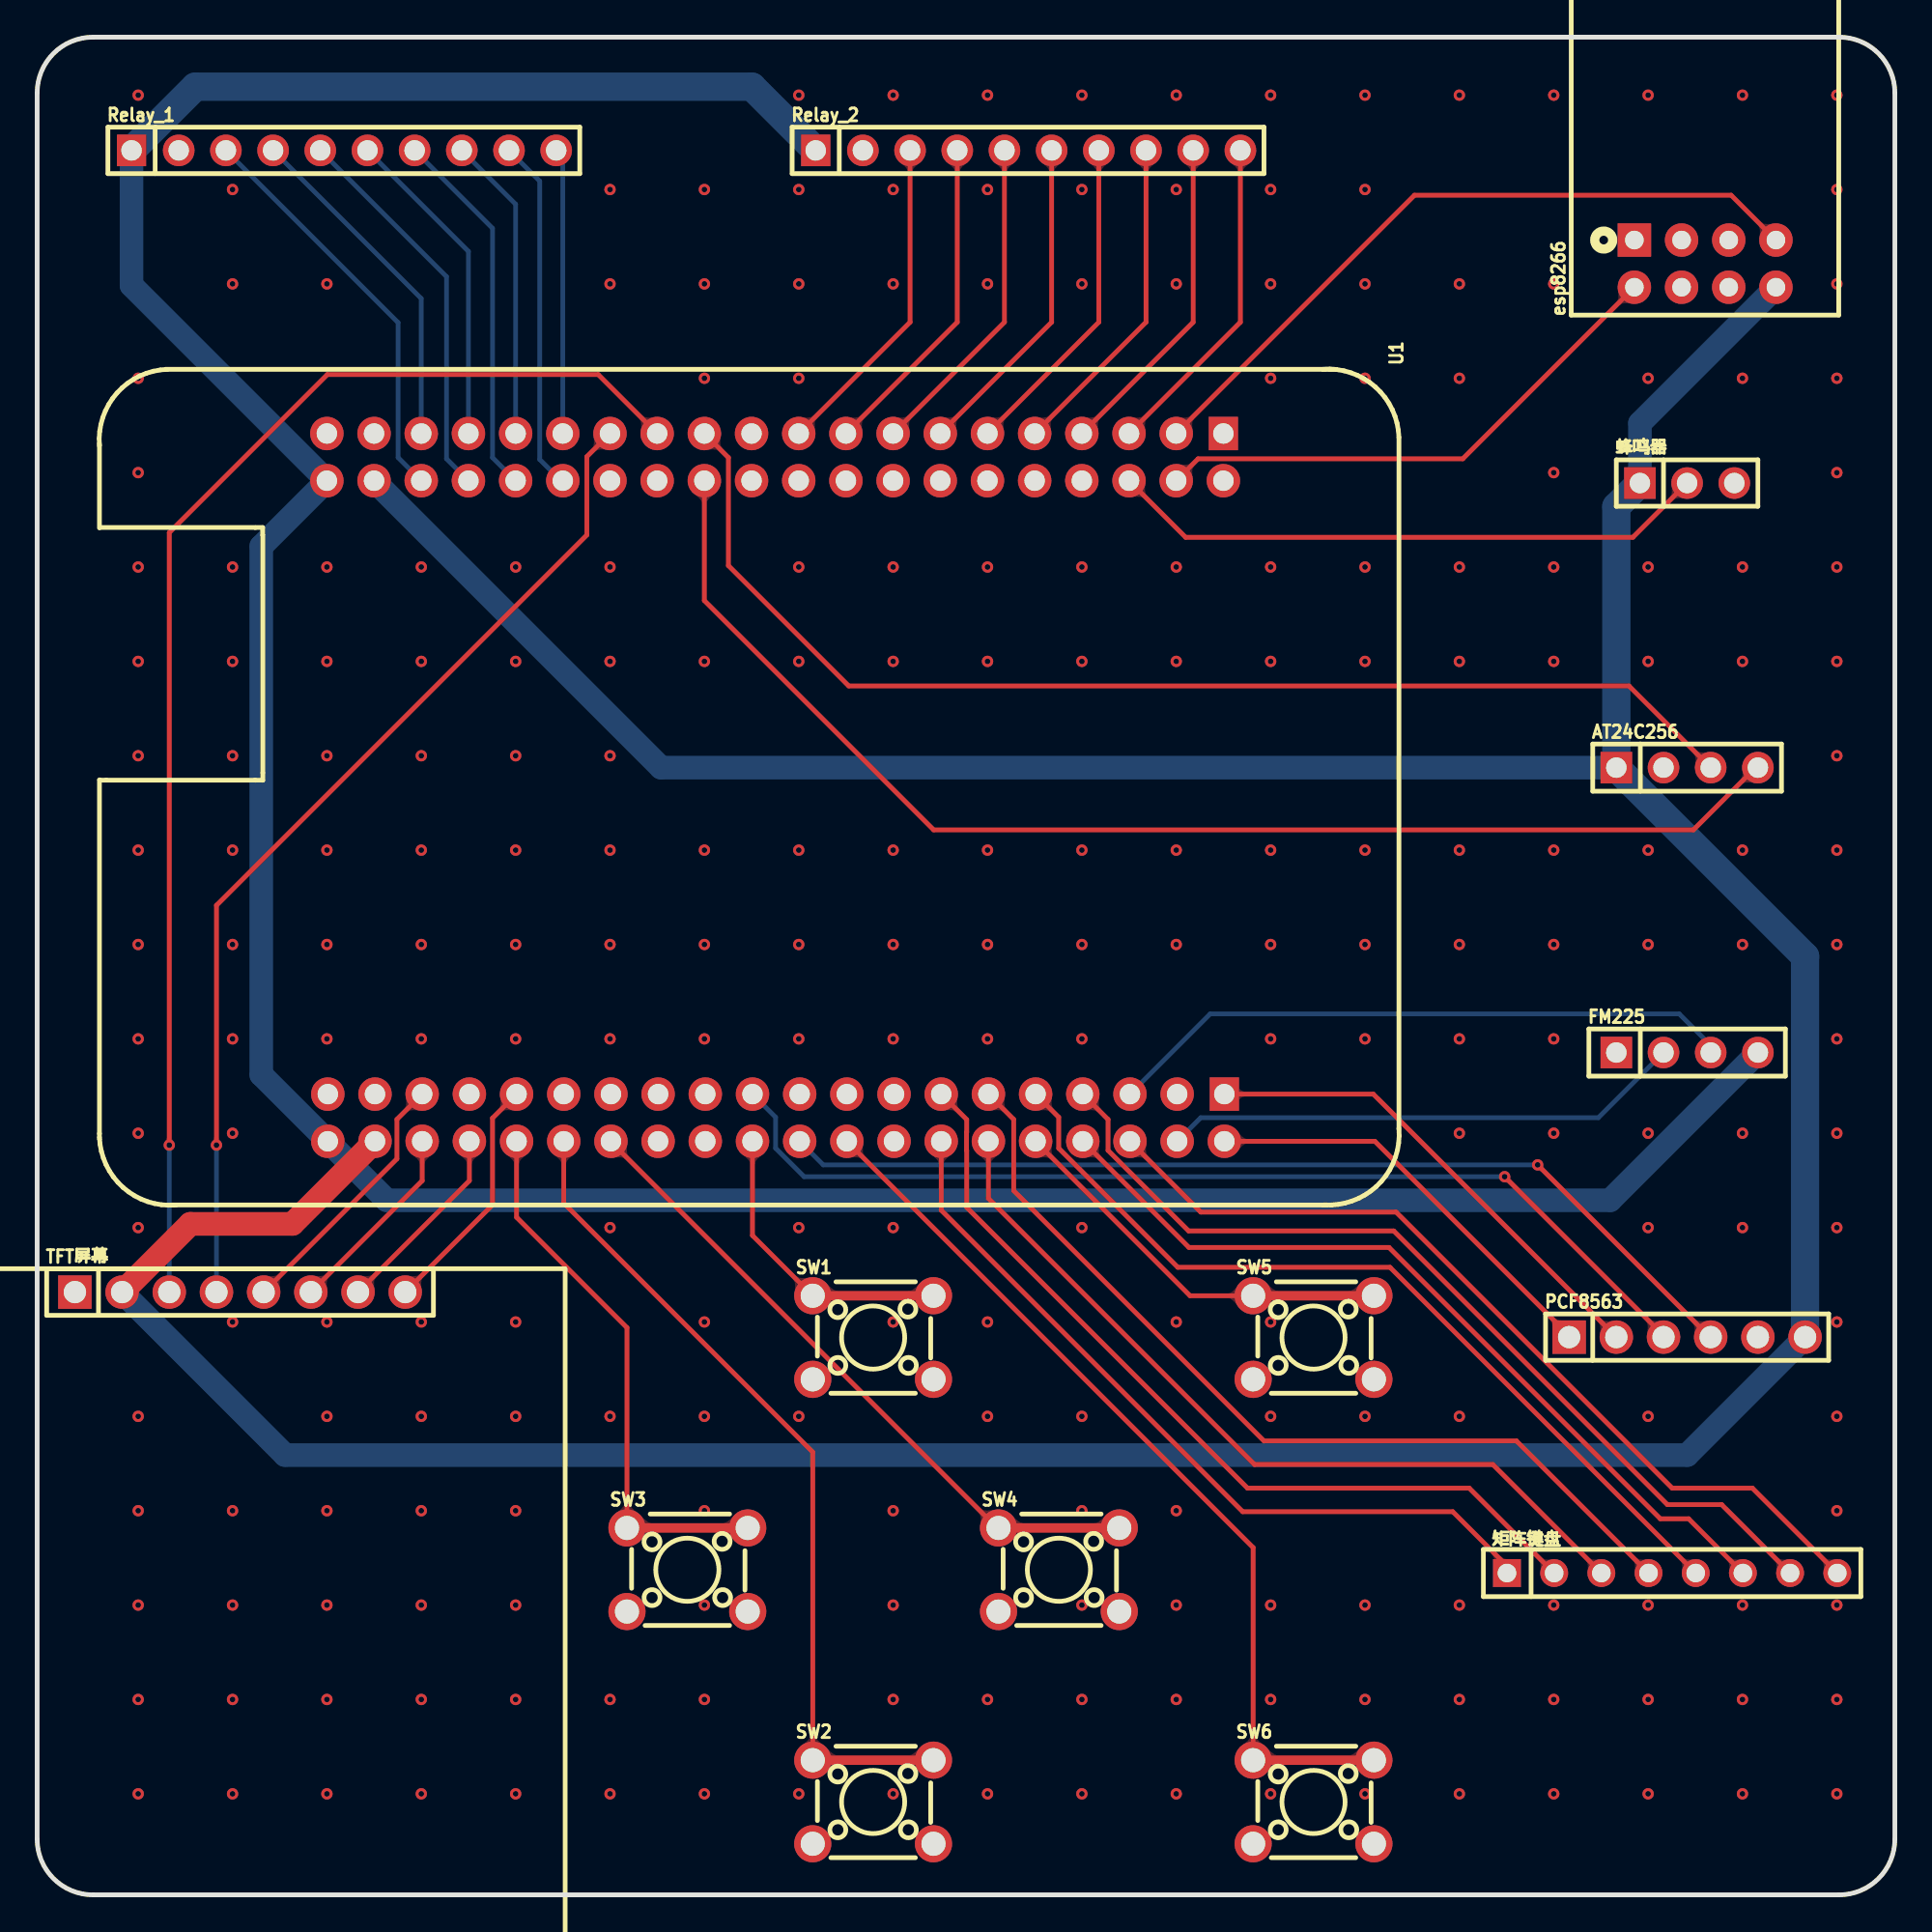
[diagram p1: board, top side]
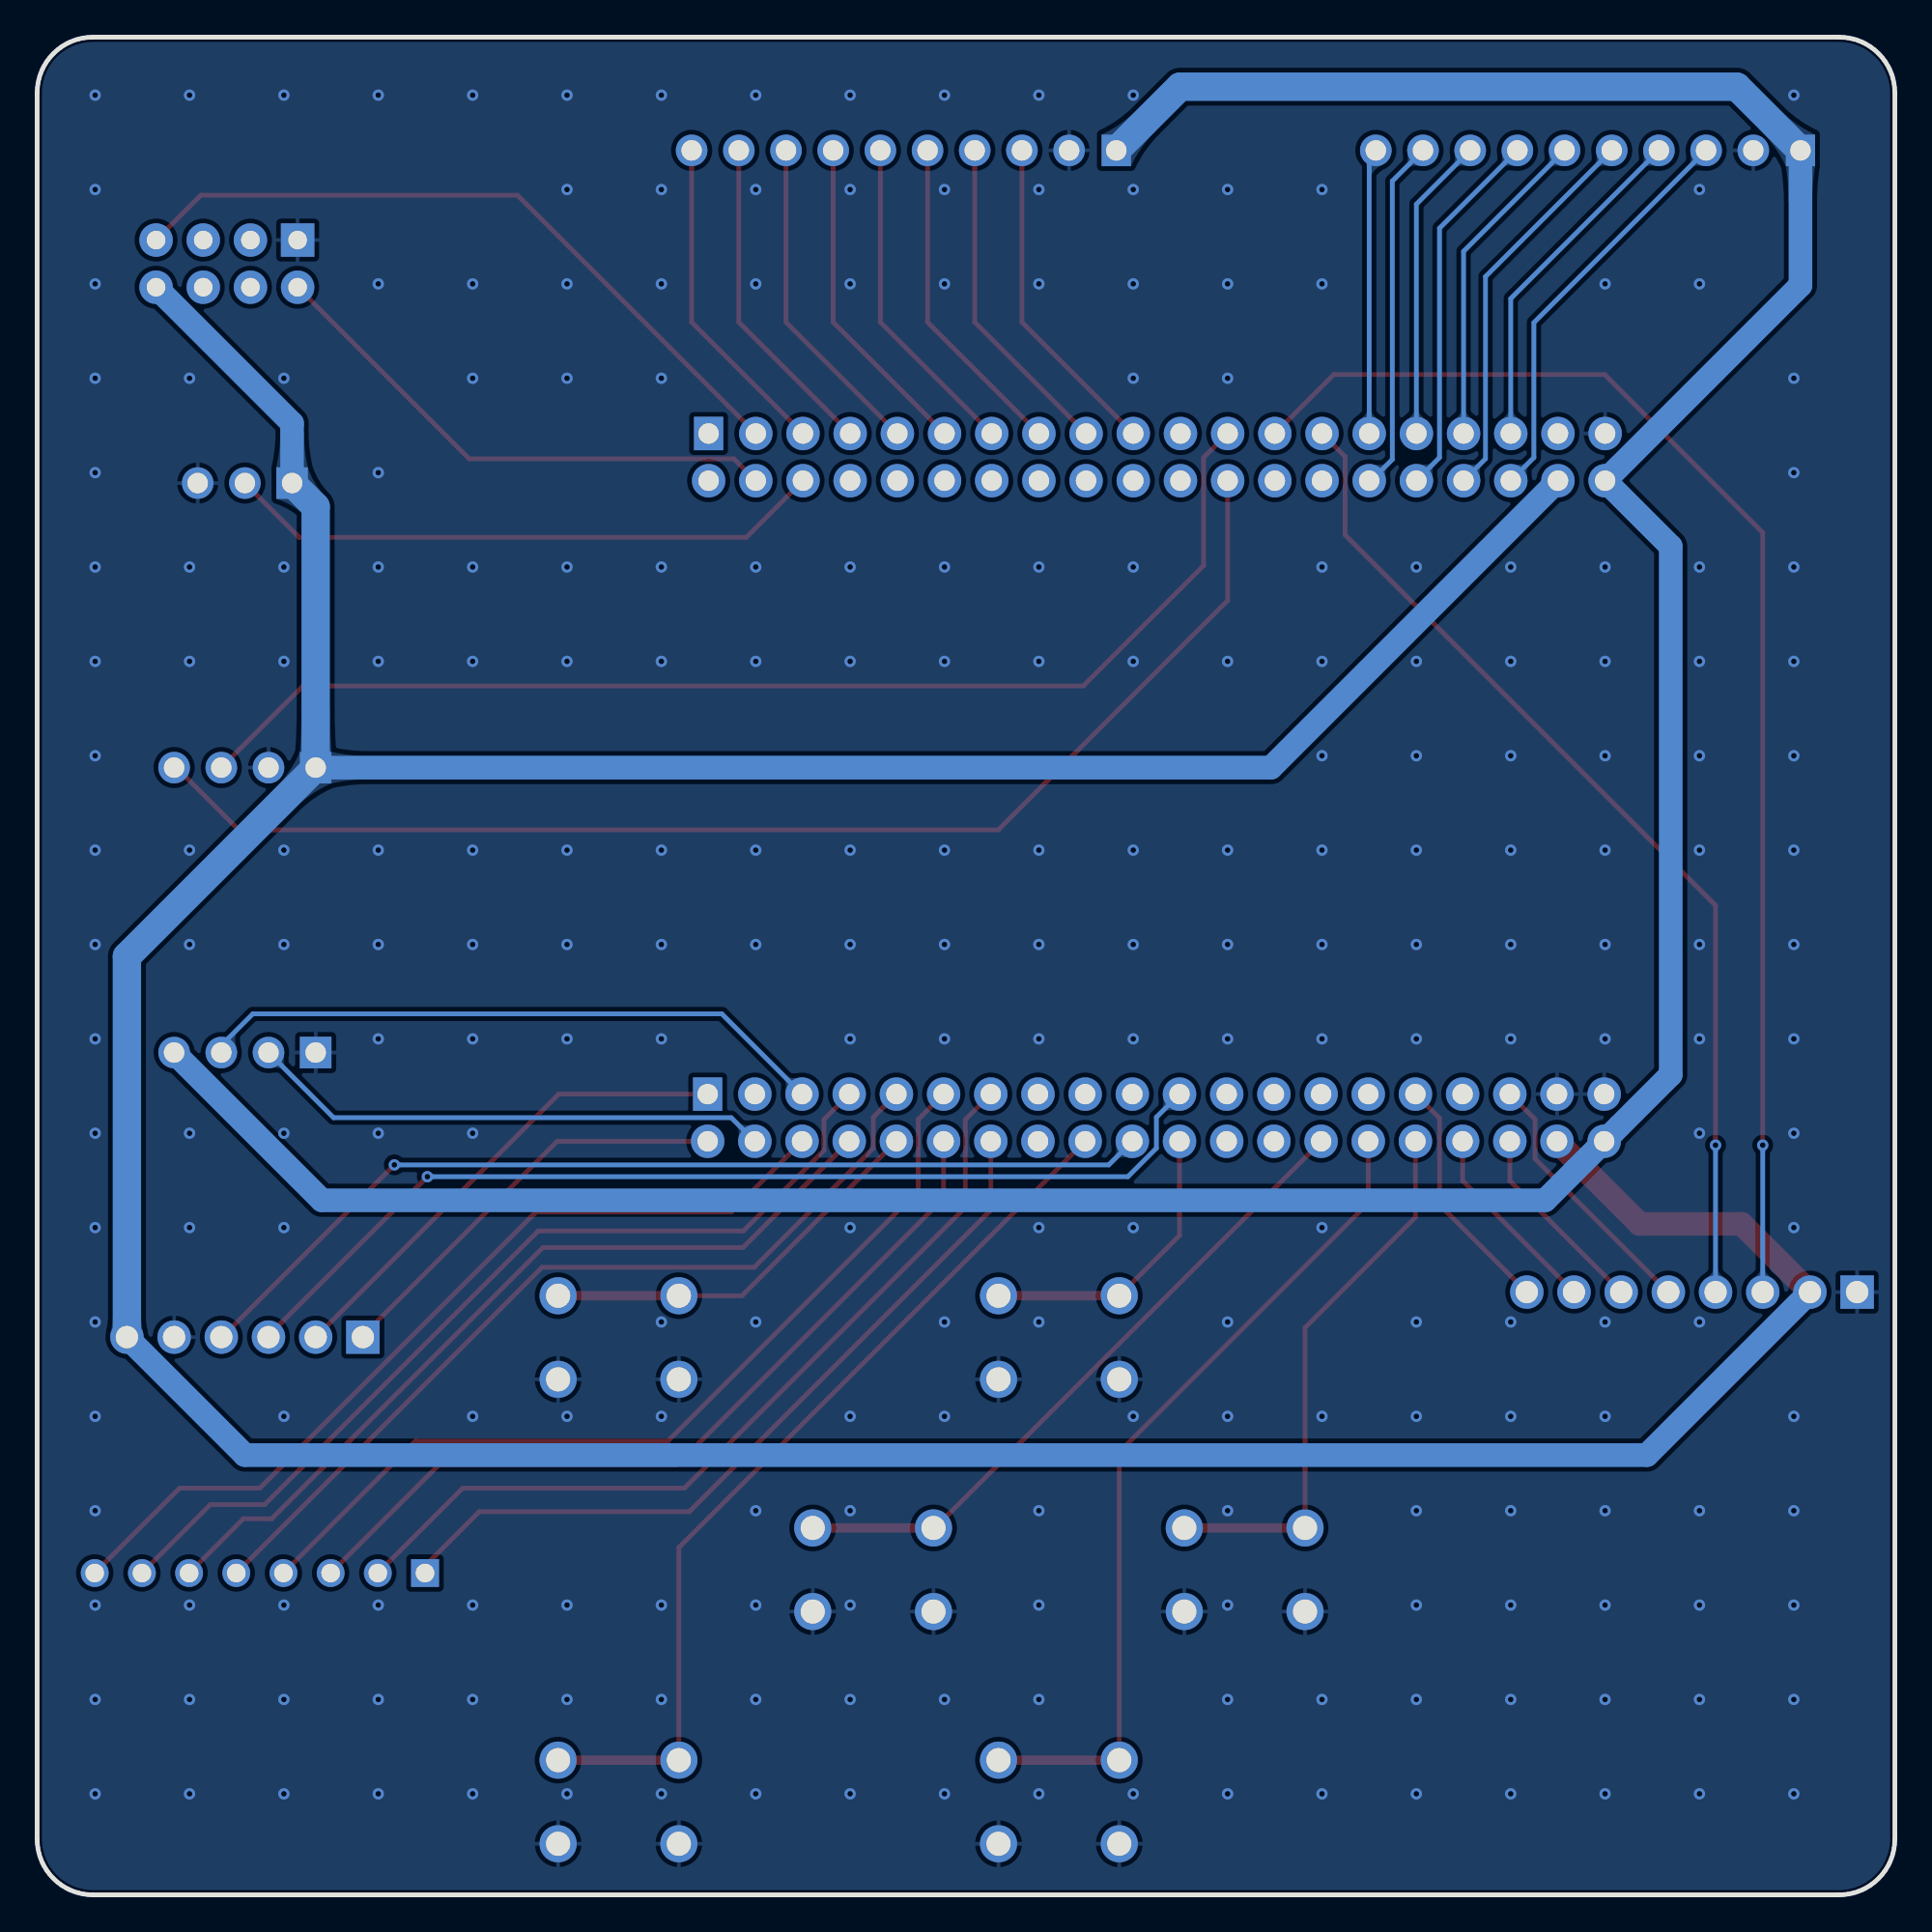
[diagram p2: board, bottom side, seen from below]

Outline 100 x 100 mm; copper layers: Top Layer, Bottom Layer. Coordinates in mm from the lower left corner of the outline.
Outline path: 0,97 0,3 arc(0.88,0.88) 3,0 97,0 arc(99.12,0.88) 100,3 100,97 arc(99.12,99.12) 97,100 3,100 arc(0.88,99.12) 0,97
Stack: Top Layer 0.035mm / Dielectric1 1.51mm FR4 er 4.5 / Bottom Layer 0.035mm

## Design rules (mm)
spacing copperThickness1oz (default): track to track 0.102, other pairs 0.152 to 0.3
spacing copperThickness2oz: track to track 0.203, other pairs 0.152 to 0.3
track width copperThickness1oz (default): min 0.127, default 0.254, max 2.54
track width copperThickness2oz: min 0.203, default 0.254, max 2.54
differential pair differentialPair (default): width min 0.127, default 0.254, max 2.54; gap min 0.152, default 0.152
net GND uses copperRegion

## Placement (name value [footprint] x y rotation side)
AT24C256  -  [HDR-TH_4P-P2.54-V-M]  88.82 60.68 0 top
esp8266  Ai-Thinker ESP-01S ESP8266  [WIFIM-TH_8P-L24.7-W14.4-P2.54]  89.79 87.81 90 top
FM225  -  [HDR-TH_4P-P2.54-V-F]  88.82 45.34 0 top
PCF8563  -  [HDR-TH_6P-P2.54-V-M-1]  88.82 30.02 0 top
Relay_1  -  [HDR-TH_10P-P2.54-V-M-1]  16.51 93.9 0 top
Relay_2  -  [HDR-TH_10P-P2.54-V-M-1]  53.34 93.9 0 top
SW1  K2-1102DP-C4SW-04  [KEY-TH_4P-L6.0-W6.0-P4.50-LS6.50]  45 30 0 top
SW2  K2-1102DP-C4SW-04  [KEY-TH_4P-L6.0-W6.0-P4.50-LS6.50]  45 5 0 top
SW3  K2-1102DP-C4SW-04  [KEY-TH_4P-L6.0-W6.0-P4.50-LS6.50]  35 17.5 0 top
SW4  K2-1102DP-C4SW-04  [KEY-TH_4P-L6.0-W6.0-P4.50-LS6.50]  55 17.5 0 top
SW5  K2-1102DP-C4SW-04  [KEY-TH_4P-L6.0-W6.0-P4.50-LS6.50]  68.71 30 0 top
SW6  K2-1102DP-C4SW-04  [KEY-TH_4P-L6.0-W6.0-P4.50-LS6.50]  68.71 5 0 top
TFT屏幕  -  [HDR-TH_8P-P2.54-V-F-1]  10.92 32.45 0 top
U1  LCKFB-LSPI-SkyStar-STM32F407VET6-LITE  [COMM-TH_LCKFB-LSPI-SKYSTAR-STM32F407VET6-LITE]  39.75 59.61 270 top
矩阵键盘  -  [HDR-TH_8P-P2.54-V-M]  88.01 17.32 0 top
蜂鸣器  -  [HDR-TH_3P-P2.54-V-M]  88.82 76 0 top

## Footprints (pads in the part's own frame, mm; a bottom-side part is the same pattern mirrored in y, then rotated)
COMM-TH_LCKFB-LSPI-SKYSTAR-STM32F407VET6-LITE
  rect 1.8x1.575 hole 1.1: 1(-19.05,24.105) 41(16.51,24.155)
  round 1.8 hole 1.1: 2(-16.51,24.105) 3(-19.05,21.564) 4(-16.51,21.564) 5(-19.05,19.024) 6(-16.51,19.024) 7(-19.05,16.485) 8(-16.51,16.485) 9(-19.05,13.944) 10(-16.51,13.944) 11(-19.05,11.405) 12(-16.51,11.405) 13(-19.05,8.864) 14(-16.51,8.864) 15(-19.05,6.324) 16(-16.51,6.324) 17(-19.05,3.784) 18(-16.51,3.784) 19(-19.05,1.244) 20(-16.51,1.244) 21(-19.05,-1.296) 22(-16.51,-1.296) 23(-19.05,-3.836) 24(-16.51,-3.836) 25(-19.05,-6.375) 26(-16.51,-6.375) 27(-19.05,-8.915) 28(-16.51,-8.915) 29(-19.05,-11.456) 30(-16.51,-11.456) 31(-19.05,-13.995) 32(-16.51,-13.995) 33(-19.05,-16.535) 34(-16.51,-16.535) 35(-19.05,-19.076) 36(-16.51,-19.076) 37(-19.05,-21.616) 38(-16.51,-21.616) 39(-19.05,-24.155) 40(-16.51,-24.155) 42(19.05,24.155) 43(16.51,21.616) 44(19.05,21.616) 45(16.51,19.076) 46(19.05,19.076) 47(16.51,16.535) 48(19.05,16.535) 49(16.51,13.995) 50(19.05,13.995) 51(16.51,11.456) 52(19.05,11.456) 53(16.51,8.915) 54(19.05,8.915) 55(16.51,6.375) 56(19.05,6.375) 57(16.51,3.836) 58(19.05,3.836) 59(16.51,1.296) 60(19.05,1.296) 61(16.51,-1.244) 62(19.05,-1.244) 63(16.51,-3.784) 64(19.05,-3.784) 65(16.51,-6.324) 66(19.05,-6.324) 67(16.51,-8.864) 68(19.05,-8.864) 69(16.51,-11.405) 70(19.05,-11.405) 71(16.51,-13.944) 72(19.05,-13.944) 73(16.51,-16.485) 74(19.05,-16.485) 75(16.51,-19.024) 76(19.05,-19.024) 77(16.51,-21.564) 78(19.05,-21.564) 79(16.51,-24.105) 80(19.05,-24.105)
HDR-TH_3P-P2.54-V-M
  rect 1.7x1.7 hole 1.1: 1(-2.54,0)
  round 1.7 hole 1.1: 2(0,0) 3(2.54,0)
HDR-TH_4P-P2.54-V-F
  rect 1.7x1.7 hole 1.1: 1(-3.81,0)
  round 1.7 hole 1.1: 2(-1.27,0) 3(1.27,0) 4(3.81,0)
HDR-TH_4P-P2.54-V-M
  rect 1.7x1.7 hole 1.1: 1(-3.81,0)
  round 1.7 hole 1.1: 2(-1.27,0) 3(1.27,0) 4(3.81,0)
HDR-TH_6P-P2.54-V-M-1
  rect 1.8x1.8 hole 1.2: 1(-6.35,0)
  round 1.8 hole 1.2: 2(-3.81,0) 3(-1.27,0) 4(1.27,0) 5(3.81,0) 6(6.35,0)
HDR-TH_8P-P2.54-V-F-1
  rect 1.8x1.8 hole 1.2: 1(-8.89,0)
  round 1.8 hole 1.2: 2(-6.35,0) 3(-3.81,0) 4(-1.27,0) 5(1.27,0) 6(3.81,0) 7(6.35,0) 8(8.89,0)
HDR-TH_8P-P2.54-V-M
  rect 1.5x1.5 hole 1: 1(-8.89,0)
  round 1.5 hole 1: 2(-6.35,0) 3(-3.81,0) 4(-1.27,0) 5(1.27,0) 6(3.81,0) 7(6.35,0) 8(8.89,0)
HDR-TH_10P-P2.54-V-M-1
  rect 1.575x1.7 hole 1.1: 1(-11.43,0)
  round 1.7 hole 1.1: 2(-8.89,0) 3(-6.35,0) 4(-3.81,0) 5(-1.27,0) 6(1.27,0) 7(3.81,0) 8(6.35,0) 9(8.89,0) 10(11.43,0)
KEY-TH_4P-L6.0-W6.0-P4.50-LS6.50
  round 2 hole 1.3: 1(-3.25,2.25) 2(3.25,2.25) 3(-3.25,-2.25) 4(3.25,-2.25)
WIFIM-TH_8P-L24.7-W14.4-P2.54
  rect 1.8x1.8 hole 1: 1(1.27,3.81)
  round 1.8 hole 1: 2(1.27,1.27) 3(1.27,-1.27) 4(1.27,-3.81) 5(-1.27,3.81) 6(-1.27,1.27) 7(-1.27,-1.27) 8(-1.27,-3.81)

## Nets
As in the schematic, except:
3.3V: AT24C256.1 esp8266.8 PCF8563.6 TFT屏幕.2 U1.38 U1.78 蜂鸣器.1
GND: AT24C256.2 esp8266.1 FM225.1 PCF8563.5 Relay_1.2 Relay_2.2 SW1.3 SW1.4 SW2.3 SW2.4 SW3.3 SW3.4 SW4.3 SW4.4 SW5.3 SW5.4 SW6.3 SW6.4 TFT屏幕.1 U1.39 U1.77 U1.79 蜂鸣器.3
I2C1_SCL: PCF8563.3 U1.61
I2C1_SDA: PCF8563.4 U1.60
PCF8563_COT: PCF8563.2 U1.41
PCF8563_INT: PCF8563.1 U1.42

Pads without a net: esp8266 2 3 6 7; U1 1 2 8 10 12 14 16 18 20 21 22 26 28 37 43 55 56 57 59 63 64 65 66 67 69 73

## Via types
v1: diameter 0.61, hole 0.305, Top Layer to Bottom Layer, 254 vias

## Routing (per net, layer and track width the routed paths; a pad name or vN(x,y) marks a point on that pad's centre or on a via; arc(x,y) is an arc through that point)
3.3V: length 251.4
  Top Layer w1.27: U1.78 13.74,36.12 8.25,36.12 TFT屏幕.2
  Bottom Layer w1.27: U1.38 33.58,60.68 AT24C256.1 ; PCF8563.6 88.82,23.67 13.34,23.67 TFT屏幕.2 ; 蜂鸣器.1 86.28,79.22 esp8266.8
  Bottom Layer w1.524: 蜂鸣器.1 85.01,74.73 AT24C256.1 95.17,50.52 PCF8563.6
5V: length 181.9
  Bottom Layer w1.27: Relay_1.1 5.08,86.64 U1.40 12.06,72.59 12.06,44.15 U1.80 18.82,37.39 84.68,37.39 FM225.4
  Bottom Layer w1.524: Relay_1.1 8.51,97.33 38.48,97.33 Relay_2.1
GND:
  vias: v1(5.44,96.88) v1(5.44,81.64) v1(5.44,76.56) v1(5.44,71.48) v1(5.44,66.4) v1(5.44,61.32) v1(5.44,56.24) v1(5.44,51.16) v1(5.44,46.08) v1(5.44,41) v1(5.44,35.92) v1(5.44,25.76) v1(5.44,20.68) v1(5.44,15.6) v1(5.44,10.52) v1(5.44,5.44) v1(10.52,91.8) v1(10.52,86.72) v1(10.52,71.48) v1(10.52,66.4) v1(10.52,61.32) v1(10.52,56.24) v1(10.52,51.16) v1(10.52,46.08) v1(10.52,41) v1(10.52,30.84) v1(10.52,20.68) v1(10.52,15.6) v1(10.52,10.52) v1(10.52,5.44) v1(15.6,86.72) v1(15.6,71.48) v1(15.6,66.4) v1(15.6,61.32) v1(15.6,56.24) v1(15.6,51.16) v1(15.6,46.08) v1(15.6,30.84) v1(15.6,25.76) v1(15.6,20.68) v1(15.6,15.6) v1(15.6,10.52) v1(15.6,5.44) v1(20.68,71.48) v1(20.68,66.4) v1(20.68,61.32) v1(20.68,56.24) v1(20.68,51.16) v1(20.68,46.08) v1(20.68,30.84) v1(20.68,25.76) v1(20.68,20.68) v1(20.68,15.6) v1(20.68,10.52) v1(20.68,5.44) v1(25.76,71.48) v1(25.76,66.4) v1(25.76,61.32) v1(25.76,56.24) v1(25.76,51.16) v1(25.76,46.08) v1(25.76,30.84) v1(25.76,25.76) v1(25.76,20.68) v1(25.76,15.6) v1(25.76,10.52) v1(25.76,5.44) v1(30.84,91.8) v1(30.84,86.72) v1(30.84,71.48) v1(30.84,66.4) v1(30.84,61.32) v1(30.84,56.24) v1(30.84,51.16) v1(30.84,46.08) v1(30.84,35.92) v1(30.84,25.76) v1(30.84,10.52) v1(30.84,5.44) v1(35.92,91.8) v1(35.92,86.72) v1(35.92,81.64) v1(35.92,66.4) v1(35.92,56.24) v1(35.92,51.16) v1(35.92,46.08) v1(35.92,30.84) v1(35.92,25.76) v1(35.92,20.68) v1(35.92,15.6) v1(35.92,10.52) v1(35.92,5.44) v1(41,96.88) v1(41,91.8) v1(41,86.72) v1(41,81.64) v1(41,71.48) v1(41,66.4) v1(41,56.24) v1(41,51.16) v1(41,46.08) v1(41,35.92) v1(41,25.76) v1(41,5.44) v1(46.08,96.88) v1(46.08,91.8) v1(46.08,86.72) v1(46.08,71.48) v1(46.08,66.4) v1(46.08,56.24) v1(46.08,51.16) v1(46.08,46.08) v1(46.08,35.92) v1(46.08,30.84) v1(46.08,20.68) v1(46.08,15.6) v1(46.08,10.52) v1(46.08,5.44) v1(51.16,96.88) v1(51.16,91.8) v1(51.16,86.72) v1(51.16,71.48) v1(51.16,66.4) v1(51.16,56.24) v1(51.16,51.16) v1(51.16,46.08) v1(51.16,30.84) v1(51.16,25.76) v1(51.16,10.52) v1(51.16,5.44) v1(56.24,96.88) v1(56.24,91.8) v1(56.24,86.72) v1(56.24,71.48) v1(56.24,66.4) v1(56.24,56.24) v1(56.24,51.16) v1(56.24,46.08) v1(56.24,35.92) v1(56.24,25.76) v1(56.24,20.68) v1(56.24,15.6) v1(56.24,10.52) v1(56.24,5.44) v1(61.32,96.88) v1(61.32,91.8) v1(61.32,86.72) v1(61.32,71.48) v1(61.32,66.4) v1(61.32,56.24) v1(61.32,51.16) v1(61.32,30.84) v1(61.32,20.68) v1(61.32,15.6) v1(61.32,10.52) v1(61.32,5.44) v1(66.4,96.88) v1(66.4,91.8) v1(66.4,86.72) v1(66.4,81.64) v1(66.4,71.48) v1(66.4,66.4) v1(66.4,56.24) v1(66.4,51.16) v1(66.4,46.08) v1(66.4,30.84) v1(66.4,25.76) v1(66.4,15.6) v1(66.4,10.52) v1(66.4,5.44) v1(71.48,96.88) v1(71.48,91.8) v1(71.48,86.72) v1(71.48,81.64) v1(71.48,71.48) v1(71.48,66.4) v1(71.48,56.24) v1(71.48,51.16) v1(71.48,46.08) v1(71.48,25.76) v1(71.48,15.6) v1(71.48,10.52) v1(71.48,5.44) v1(76.56,96.88) v1(76.56,86.72) v1(76.56,81.64) v1(76.56,71.48) v1(76.56,66.4) v1(76.56,56.24) v1(76.56,51.16) v1(76.56,46.08) v1(76.56,41) v1(76.56,25.76) v1(76.56,15.6) v1(76.56,10.52) v1(76.56,5.44) v1(81.64,96.88) v1(81.64,86.72) v1(81.64,76.56) v1(81.64,71.48) v1(81.64,66.4) v1(81.64,56.24) v1(81.64,51.16) v1(81.64,46.08) v1(81.64,41) v1(81.64,15.6) v1(81.64,10.52) v1(81.64,5.44) v1(86.72,96.88) v1(86.72,81.64) v1(86.72,71.48) v1(86.72,66.4) v1(86.72,56.24) v1(86.72,51.16) v1(86.72,41) v1(86.72,35.92) v1(86.72,25.76) v1(86.72,15.6) v1(86.72,10.52) v1(86.72,5.44) v1(91.8,96.88) v1(91.8,81.64) v1(91.8,71.48) v1(91.8,66.4) v1(91.8,56.24) v1(91.8,51.16) v1(91.8,41) v1(91.8,35.92) v1(91.8,15.6) v1(91.8,10.52) v1(91.8,5.44) v1(96.88,96.88) v1(96.88,91.8) v1(96.88,86.72) v1(96.88,81.64) v1(96.88,76.56) v1(96.88,71.48) v1(96.88,66.4) v1(96.88,61.32) v1(96.88,56.24) v1(96.88,51.16) v1(96.88,46.08) v1(96.88,41) v1(96.88,35.92) v1(96.88,30.84) v1(96.88,25.76) v1(96.88,20.68) v1(96.88,15.6) v1(96.88,10.52) v1(96.88,5.44)
AT24C256_SCL: length 65
  Top Layer w0.254: U1.23 37.21,77.37 37.21,71.55 43.69,65.08 85.69,65.08 AT24C256.3
AT24C256_SDA: length 69.7
  Top Layer w0.254: AT24C256.4 92.5,60.68 89.15,57.33 48.26,57.33 35.92,69.67 U1.24
BUZZER_IO: length 32.5
  Top Layer w0.254: U1.6 61.82,73.08 85.9,73.08 蜂鸣器.2
COL1: length 42.5
  Top Layer w0.254: 矩阵键盘.1 79.12,17.7 76.2,20.62 64.9,20.62 48.67,36.86 U1.54
COL2: length 46.4
  Top Layer w0.254: 矩阵键盘.2 77.09,21.9 65.15,21.9 50.04,37.01 50.04,40.06 50.03,40.08 50.03,41.05 50.04,41.06 50.04,41.73 U1.53
COL3: length 44.4
  Top Layer w0.254: 矩阵键盘.3 78.36,23.16 65.53,23.16 51.21,37.49 U1.52
COL4: length 48.5
  Top Layer w0.254: 矩阵键盘.4 79.63,24.44 66.04,24.44 52.57,37.91 52.57,41.74 U1.51
ESP_RX: length 38.6
  Top Layer w0.254: esp8266.4 91.19,91.49 74.14,91.49 U1.3
ESP_TX: length 29
  Top Layer w0.254: 85.98,86.54 76.74,77.3 62.49,77.3 U1.4
FM225_RX: length 28.2
  Bottom Layer w0.254: U1.44 62.64,41.83 84.04,41.83 FM225.2
FM225_TX: length 34.1
  Bottom Layer w0.254: FM225.3 90.09,45.73 88.39,47.42 63.14,47.42 U1.45
I2C1_SCL: length 55.5
  Top Layer w0.254: PCF8563.3 87.55,30.11 v1(78.99,38.66)
  Bottom Layer w0.254: U1.61 39.75,41.86 39.75,40.19 41.28,38.66 v1(78.99,38.66)
I2C1_SDA: length 53.4
  Top Layer w0.254: v1(80.77,39.29) 90.04,30.02 PCF8563.4
  Bottom Layer w0.254: U1.60 42.32,39.29 v1(80.77,39.29)
PCF8563_COT: length 26.5
  Top Layer w0.254: PCF8563.2 71.93,43.1 U1.41
PCF8563_INT: length 23
  Top Layer w0.254: PCF8563.1 82.47,30.11 72.01,40.56 U1.42
RELAY1: length 22.1
  Bottom Layer w0.254: U1.36 19.43,77.37 19.43,84.63 Relay_1.3
RELAY2: length 18.5
  Bottom Layer w0.254: Relay_1.4 20.68,85.93 U1.35
RELAY3: length 21.1
  Bottom Layer w0.254: U1.34 22.04,77.3 22.04,87.11 Relay_1.5
RELAY4: length 17.5
  Bottom Layer w0.254: Relay_1.6 23.22,88.47 U1.33
RELAY5: length 20
  Bottom Layer w0.254: U1.32 24.51,77.37 24.51,89.71 Relay_1.7
RELAY6: length 16.4
  Bottom Layer w0.254: Relay_1.8 25.76,91.01 U1.31
RELAY7: length 19
  Bottom Layer w0.254: U1.30 28.19,76.12 27.05,77.27 27.05,92.25 Relay_1.9
RELAY8: length 15.4
  Bottom Layer w0.254: U1.29 28.3,93.55 Relay_1.10
RELAY9: length 17.7
  Top Layer w0.254: Relay_2.3 46.99,84.66 U1.19
RELAY10: length 17.7
  Top Layer w0.254: Relay_2.4 49.53,84.66 U1.17
RELAY11: length 17.7
  Top Layer w0.254: U1.15 52.07,84.66 Relay_2.5
RELAY12: length 17.7
  Top Layer w0.254: U1.13 54.61,84.66 Relay_2.6
RELAY13: length 17.7
  Top Layer w0.254: Relay_2.7 57.15,84.66 U1.11
RELAY14: length 17.7
  Top Layer w0.254: U1.9 59.69,84.66 Relay_2.8
RELAY15: length 17.7
  Top Layer w0.254: U1.7 62.23,84.66 Relay_2.9
RELAY16: length 17.7
  Top Layer w0.254: U1.5 64.77,84.66 Relay_2.10
ROW1: length 47.2
  Top Layer w0.254: U1.49 54.99,41.86 54.99,40.19 61.4,33.78 72.82,33.78 矩阵键盘.5
ROW2: length 45.2
  Top Layer w0.254: 矩阵键盘.6 88.9,20.24 87.38,20.24 72.77,34.85 62,34.85 U1.48
ROW3: length 49.7
  Top Layer w0.254: U1.47 57.65,41.74 57.65,40.08 61.99,35.74 73.03,35.74 87.76,21.01 90.68,21.01 矩阵键盘.7
ROW4: length 47.7
  Top Layer w0.254: U1.46 62.64,36.75 73.15,36.75 88.01,21.9 92.33,21.9 矩阵键盘.8
SPI2_MOSI: length 55
  Top Layer w0.254: U1.27 29.59,77.42 29.59,73.2 9.65,53.26 v1(9.65,40.36)
  Bottom Layer w0.254: v1(9.65,40.36) TFT屏幕.4
SPI2_SCK: length 72
  Top Layer w0.254: U1.25 30.2,81.84 15.62,81.84 7.11,73.33 v1(7.11,40.36)
  Bottom Layer w0.254: v1(7.11,40.36) TFT屏幕.3
SW1: length 16.2
  Top Layer w0.254: SW1.1 38.51,35.49 U1.62
  Top Layer w0.508: SW1.1 SW1.2
SW2: length 45.4
  Top Layer w0.254: SW2.1 41.75,23.83 28.35,37.24 U1.70
  Top Layer w0.508: SW2.1 SW2.2
SW3: length 29.8
  Top Layer w0.254: U1.72 25.81,36.47 31.75,30.53 SW3.1
  Top Layer w0.508: SW3.1 SW3.2
SW4: length 35.9
  Top Layer w0.254: 51.68,19.75 30.89,40.54 U1.68
  Top Layer w0.508: SW4.1 SW4.2
SW5: length 21.7
  Top Layer w0.254: U1.50 62.06,32.25 SW5.1
  Top Layer w0.508: SW5.1 SW5.2
SW6: length 48.9
  Top Layer w0.254: SW6.1 65.46,18.69 U1.58
  Top Layer w0.508: SW6.1 SW6.2
TFT_BL: length 13.1
  Top Layer w0.254: TFT屏幕.8 24.51,37.14 24.51,41.81 U1.71
TFT_CS: length 10.6
  Top Layer w0.254: TFT屏幕.7 23.27,38.44 U1.74
TFT_DC: length 10.6
  Top Layer w0.254: TFT屏幕.6 20.73,38.44 U1.76
TFT_RES: length 14.2
  Top Layer w0.254: TFT屏幕.5 19.37,39.62 19.37,41.74 U1.75

## Copper pours and planes (outline as drawn; the poured copper is in the pictures)
GND on Top Layer: -43.69,113.46 172.47,113.46 172.47,-35.13 -43.69,-35.13
GND on Bottom Layer: -30.1,117.27 142.49,117.27 142.49,-23.32 -30.1,-23.32

Small or netless copper shapes (teardrops, artwork), in the pictures only: 88 on Top Layer, 46 on Bottom Layer
